# Altium project Converter.PrjPCB
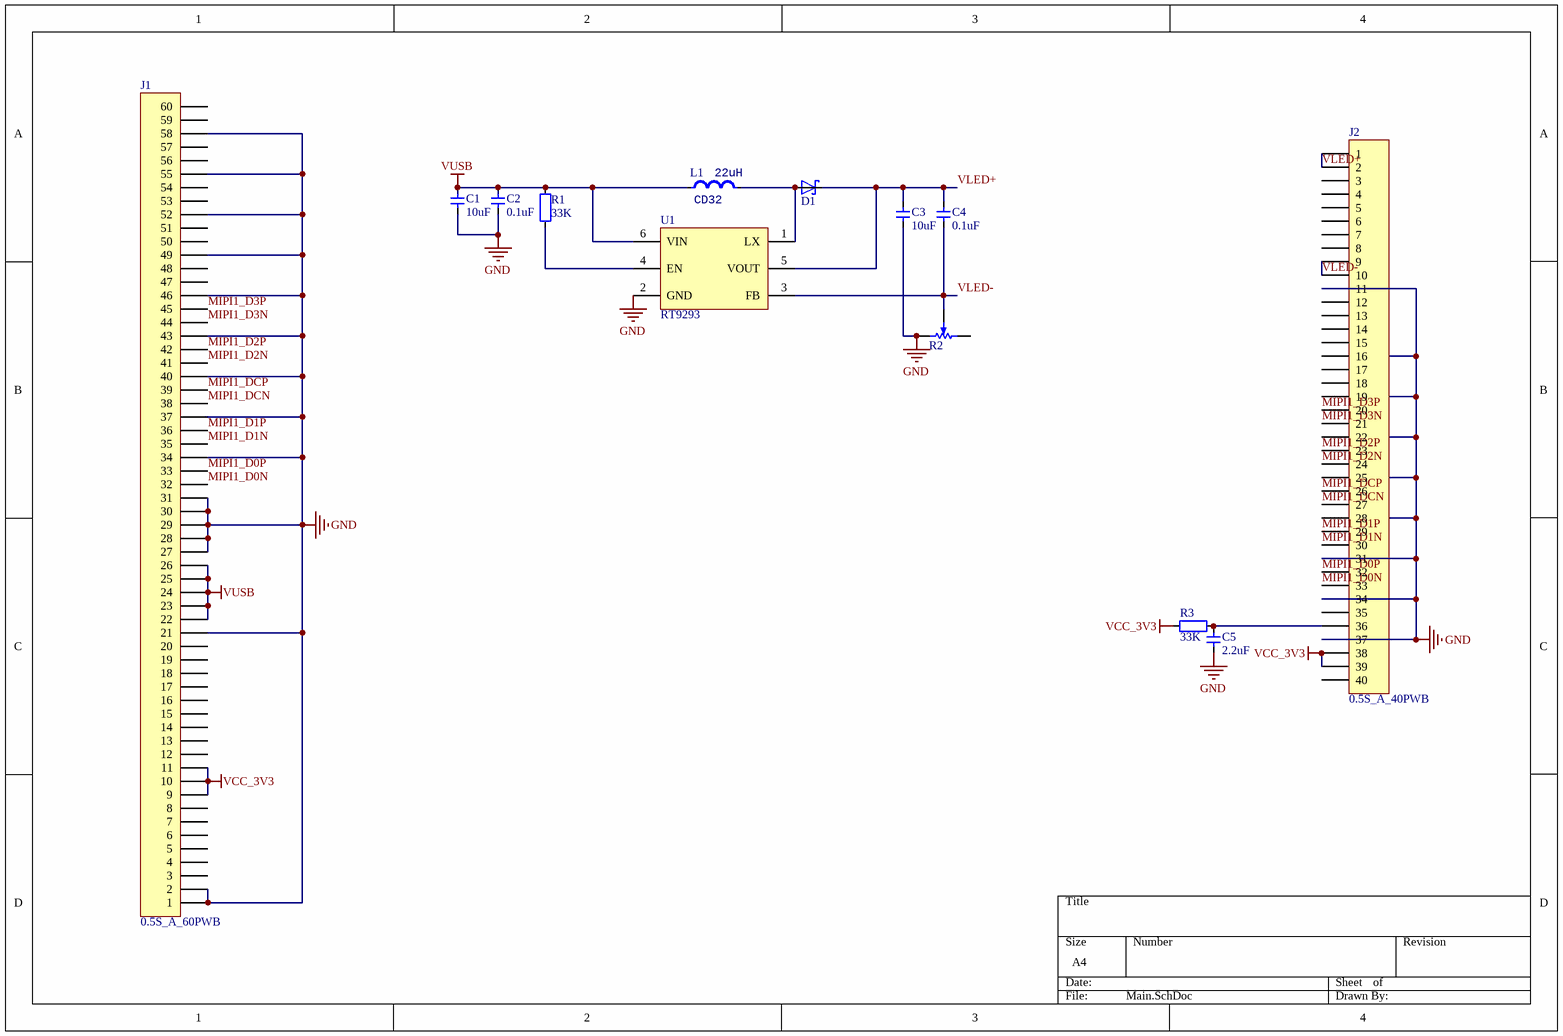
[diagram p0: Main.SchDoc]
1 sheet, 13 parts. Net scope: global (net labels, ports and power ports of the same name join across sheets).
Board file: Converter.PcbDoc

## Sheet Main.SchDoc
size A4

### Parts
C1  10uF  [CAP_0402]
C2  0.1uF  [CAP_0402]
C3  10uF  [CAP_0402]
C4  0.1uF  [CAP_0402]
C5  2.2uF  [CAP_0402]
D1  RSX501L-20  [DO-214]  (value not drawn)
J1  0.5S_A_60PWB  [FFC_0.5_60]
J2  0.5S_A_40PWB  [FFC_0.5_40]
L1  value 22uH  [IND_CD32]  (hidden comment: CD32)
R1  33K  [RES_0402]
R2  电位器-贴片  [贴片电位器 3*3]  (value not drawn)
R3  33K  [RES_0402]
U1  RT9293  [SOT23-6]

### Nets
GND: C1.1 C2.1 C3.1 C5.2 J1.1 J1.2 J1.21 J1.27 J1.28 J1.29 J1.30 J1.31 J1.34 J1.37 J1.40 J1.43 J1.46 J1.49 J1.52 J1.55 J1.58 J2.11 J2.16 J2.19 J2.22 J2.25 J2.28 J2.31 J2.34 J2.37 R2.1(+) U1.2(GND)
VCC_3V3: J1.9 J1.10 J1.11 J2.38 J2.39 R3.2
VUSB: C1.2 C2.2 J1.22 J1.23 J1.24 J1.25 J1.26 L1.1 R1.2 U1.6(VIN)
MIPI1_D0N: J1.32 J2.33
MIPI1_D0P: J1.33 J2.32
MIPI1_D1N: J1.35 J2.30
MIPI1_D1P: J1.36 J2.29
MIPI1_D2N: J1.41 J2.24
MIPI1_D2P: J1.42 J2.23
MIPI1_D3N: J1.44 J2.21
MIPI1_D3P: J1.45 J2.20
MIPI1_DCN: J1.38 J2.27
MIPI1_DCP: J1.39 J2.26
VLED+: C3.2 C4.2 D1.1 J2.1 J2.2 U1.5(VOUT)
VLED-: C4.1 J2.9 J2.10 R2.3(W) U1.3(FB)
NetC5_1: C5.1 J2.36 R3.1
NetD1_2: D1.2 L1.2 U1.1(LX)
NetR1_1: R1.1 U1.4(EN)

Not connected (* = marked no-connect by the designer): J1 3 4 5 6 7 8 12 13 14 15 16 17 18 19 20 47 48 50 51 53 54 56 57 59 60; J2 3 4 5 6 7 8 12 13 14 15 17 18 35 40; R2 2(-)

### Library data of the parts
C1-C5 = 电容-0402: Capacitor; Value: 0.1u
D1 = RSX501L-20: Diode Schottky 40V 1A Surface Mount SMA _DO-214AC_; MP: SS14; MF: ON Semiconductor; Package: DO-214AC-214 ON Semiconductor; Value: *; Availability: Unavailable; Price: None; SnapEDA_Link: https://www.snapeda.com/parts/SS14/ON%20Semiconductor/view-part/1413348/?ref=snap
J1 = FPC60-0.5mm: Header, 60-Pin; LatestRevisionDate: 17-Jul-2002; LatestRevisionNote: Re-released for DXP Platform.; Publisher: Altium Limited
J2 = FPC40-0.5mm: Header, 40-Pin; LatestRevisionDate: 17-Jul-2002; LatestRevisionNote: Re-released for DXP Platform.; Publisher: Altium Limited
L1 = Ind_CD32: Inductor; Specification: ±5% 100mA; Manufacturer: *; Type: CD32
R1 R3 = 电阻-0402: Resistor; Value: 22R
U1 = RT9293: LCD-LED Driver
R2 = 电位器-贴片: Published: 17-Dec-2003; DatasheetVersion: Oct-2003; PackageReference: POT4MM-2; Publisher: Altium Limited; PackageDescription: Square Trimming Potentiometer; ComponentLink1Description: Manufacturer Link; ComponentLink1URL: http://bourns.com/2/search.html